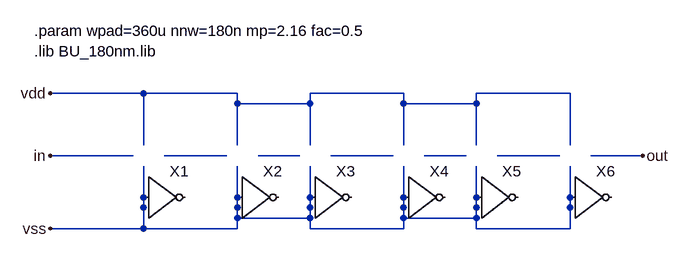
[diagram p0: schematic pad_buffer.asc]
pad_buffer.asc, the LTspice schematic file:
Version 4
SHEET 1 1168 680
WIRE 128 224 -16 224
WIRE 272 224 128 224
WIRE 528 224 384 224
WIRE 784 224 640 224
WIRE 272 240 272 224
WIRE 384 240 384 224
WIRE 384 240 272 240
WIRE 528 240 528 224
WIRE 640 240 640 224
WIRE 640 240 528 240
WIRE 128 304 128 224
WIRE 272 304 272 240
WIRE 384 304 384 240
WIRE 528 304 528 240
WIRE 640 304 640 240
WIRE 784 304 784 224
WIRE 112 320 -16 320
WIRE 256 320 160 320
WIRE 368 320 304 320
WIRE 512 320 416 320
WIRE 624 320 560 320
WIRE 768 320 672 320
WIRE 896 320 816 320
WIRE 272 416 272 336
WIRE 384 416 384 336
WIRE 384 416 272 416
WIRE 528 416 528 336
WIRE 640 416 640 336
WIRE 640 416 528 416
WIRE 128 432 128 336
WIRE 128 432 -16 432
WIRE 272 432 272 416
WIRE 272 432 128 432
WIRE 384 432 384 416
WIRE 528 432 528 416
WIRE 528 432 384 432
WIRE 640 432 640 416
WIRE 784 432 784 336
WIRE 784 432 640 432
FLAG -16 224 vdd
FLAG -16 320 in
FLAG 896 320 out
FLAG -16 432 vss
SYMBOL inv 128 320 R0
SYMATTR InstName X1
SYMATTR SpiceLine ll=180n wn={nnw} wp={nnw*mp}
SYMBOL inv 272 320 R0
SYMATTR InstName X2
SYMATTR SpiceLine ll=180n wn={10*nnw} wp={10*nnw*mp}
SYMBOL inv 384 320 R0
SYMATTR InstName X3
SYMATTR SpiceLine ll=180n wn={50*nnw} wp={50*nnw*mp}
SYMBOL inv 528 320 R0
SYMATTR InstName X4
SYMATTR SpiceLine ll=180n wn={100*nnw} wp={100*nnw*mp}
SYMBOL inv 640 320 R0
SYMATTR InstName X5
SYMATTR SpiceLine ll=180n wn={500*nnw} wp={500*nnw*mp}
SYMBOL inv 784 320 R0
SYMATTR InstName X6
SYMATTR SpiceLine ll=180n wn={1500*nnw} wp={1500*nnw*mp}
TEXT -40 128 Left 2 !.param wpad=360u nnw=180n mp=2.16 fac=0.5\n.lib BU_180nm.lib

The netlist it stands for:
* pad_buffer.asc
A§X1 vss vss vss vss vss vss vss vss BUF ll=180n wn={nnw} wp={nnw*mp}
A§X2 vss vss vss vss vss vss vss vss BUF ll=180n wn={10*nnw} wp={10*nnw*mp}
A§X3 vss vss vss vss vss vss vss vss BUF ll=180n wn={50*nnw} wp={50*nnw*mp}
A§X4 vss vss vss vss vss vss vss vss BUF ll=180n wn={100*nnw} wp={100*nnw*mp}
A§X5 vss vss vss vss vss vss vss vss BUF ll=180n wn={500*nnw} wp={500*nnw*mp}
A§X6 vss vss vss vss vss vss vss vss BUF ll=180n wn={1500*nnw} wp={1500*nnw*mp}
.param wpad=360u nnw=180n mp=2.16 fac=0.5
.lib BU_180nm.lib
.backanno
.end